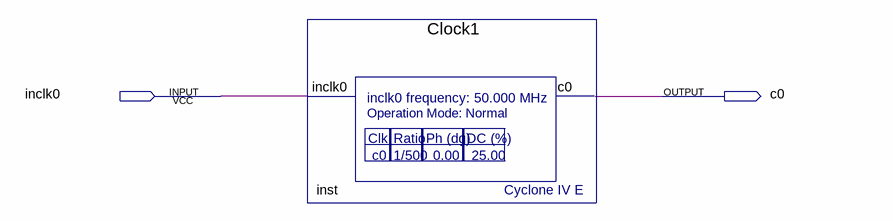
[diagram p0: schematic sheet]
// Quartus schematic clockTest.bdf as structural Verilog: 1 symbols, 2 pins
module clockTest (
  input  inclk0,
  output c0
);

  Clock1 inst (.inclk0(inclk0), .c0(c0));
endmodule
